# EAGLE design board (EAGLE 9.6.2)
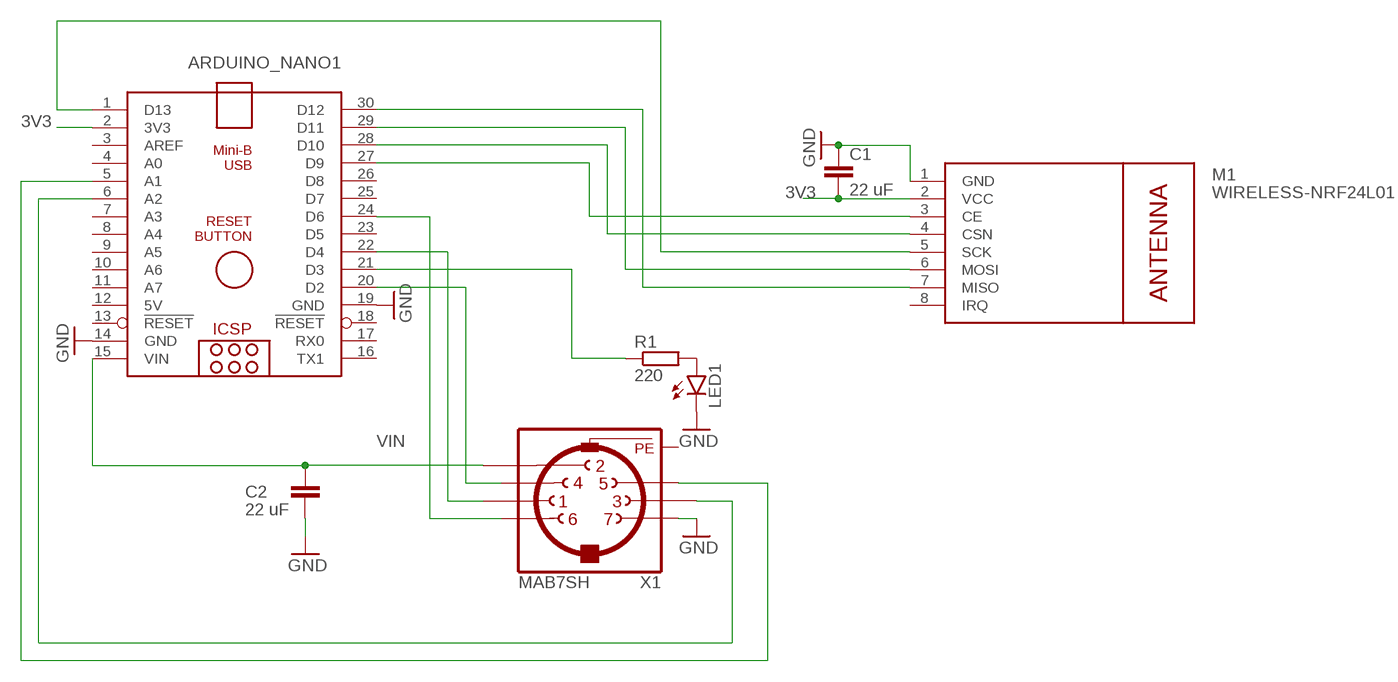
[diagram p0: schematic, sheet 1]

## Parts
ARDUINO_NANO1  ARDUINO_NANO  [ARDUINO_NANO]
C1  22 uF  C-EUC0805  [C0805]
C2  22 uF  C-EUC0805  [C0805]
LED1  LED5MM  [LED5MM]
M1  WIRELESS-NRF24L01  [WIRELESS-NRF24L01]
R1  220  R-EU_R0805  [R0805]
X1  MAB7SH  [MAB7SH]

## Nets
3V3: ARDUINO_NANO1.2(3V3) C1.2 M1.2(VCC)
GND: ARDUINO_NANO1.14(GND) ARDUINO_NANO1.19(GND) C1.1 C2.2 LED1.K(C) M1.1(GND) X1.7
N$1: ARDUINO_NANO1.1(D13) M1.5(SCK)
N$2: ARDUINO_NANO1.30(D12) M1.7(MISO)
N$3: ARDUINO_NANO1.29(D11) M1.6(MOSI)
N$4: ARDUINO_NANO1.28(D10) M1.4(CSN)
N$5: ARDUINO_NANO1.27(D9) M1.3(CE)
N$6: LED1.A R1.2
N$7: ARDUINO_NANO1.21(D3) R1.1
N$8: ARDUINO_NANO1.24(D6) X1.6
N$10: ARDUINO_NANO1.22(D4) X1.1
N$11: ARDUINO_NANO1.5(A1) X1.5
N$12: ARDUINO_NANO1.20(D2) X1.4
N$13: ARDUINO_NANO1.6(A2) X1.3
VIN: ARDUINO_NANO1.15(VIN) C2.1 X1.2
Unconnected: ARDUINO_NANO1.3(AREF) ARDUINO_NANO1.4(A0) ARDUINO_NANO1.7(A3) ARDUINO_NANO1.8(A4) ARDUINO_NANO1.9(A5) ARDUINO_NANO1.10(A6) ARDUINO_NANO1.11(A7) ARDUINO_NANO1.13(!RESET) ARDUINO_NANO1.16(TX1) ARDUINO_NANO1.17(RX0) ARDUINO_NANO1.18(!RESET) ARDUINO_NANO1.23(D5) ARDUINO_NANO1.25(D7) ARDUINO_NANO1.26(D8) M1.8(IRQ)

## Power pins joined to a net without a drawn wire
5V: ARDUINO_NANO1.12(5V)
PE: X1.PE X1.PE@(PE)

## Library data of the parts
ARDUINO_NANO1 = ArduinoNanoV30:ARDUINO_NANO: Arduino Nano V3.0 Overview: The Arduino Nano is a small, complete, and breadboard-friendly board based on the ATmega328 (Arduino Nano 3.x) or ATmega168 (Arduino Nano 2.x). It has more or less the same functionality of the Arduino Duemilanove, but in a different package. It lacks only a DC power jack, and works with a Mini-B USB cable instead of a standard one. The Nano was designed and is being produced by Gravitech. Specifications: Microcontroller Atmel ATmega168 or ATmega328 Operating Voltage (logic level) 5 V Input Voltage (recommended) 7-12 V Input Voltage (limits) 6-20 V Digital I/O Pins 14 (of which 6 provide PWM output) Analog Input Pins 8 DC Current per I/O Pin 40 mA Flash Memory 16 KB (ATmega168) or 32 KB (ATmega328) of which 2 KB used by bootloader SRAM 1 KB (ATmega168) or 2 KB (ATmega328) EEPROM 512 bytes (ATmega168) or 1 KB (ATmega328) Clock Speed 16 MHz Dimensions 0.73" x 1.70" Length 45 mm Width 18 mm Weigth 5 g Power: The Arduino Nano can be powered via the Mini-B USB connection, 6-20V unregulated external power supply (pin 30), or 5V regulated external power supply (pin 27). The power source is automatically selected to the highest voltage source. Memory: The ATmega168 has 16 KB of flash memory for storing code (of which 2 KB is used for the bootloader); the ATmega328 has 32 KB, (also with 2 KB used for the bootloader). The ATmega168 has 1 KB of SRAM and 512 bytes of EEPROM (which can be read and written with the EEPROM library); the ATmega328 has 2 KB of SRAM and 1 KB of EEPROM. Input and Output: Each of the 14 digital pins on the Nano can be used as an input or output, using pinMode(), digitalWrite(), and digitalRead() functions. They operate at 5 volts. Each pin can provide or receive a maximum of 40 mA and has an internal pull-up resistor (disconnected by default) of 20-50 kOhms. In addition, some pins have specialized functions. Visit Arduino - ArduinoBoardNano <https://www.arduino.cc/en/Main/ArduinoBoardNano>
C1 C2 = rcl:C-EU: CAPACITOR, European symbol; SPICEPREFIX: C
LED1 = led:LED: LED OSRAM: - CHIPLED LG R971, LG N971, LY N971, LG Q971, LY Q971, LO R971, LY R971 LH N974, LH R974 LS Q976, LO Q976, LY Q976 LO Q996 - Hyper CHIPLED LW Q18S LB Q993, LB Q99A, LB R99A - SideLED LS A670, LO A670, LY A670, LG A670, LP A670 LB A673, LV A673, LT A673, LW A673 LH A674 LY A675 LS A676, LA A676, LO A676, LY A676, LW A676 LS A679, LY A679, LG A679 - Hyper Micro SIDELED® LS Y876, LA Y876, LO Y876, LY Y876 LT Y87S - SmartLED LW L88C, LW L88S LB L89C, LB L89S, LG L890 LS L89K, LO L89K, LY L89K LS L896, LA L896, LO L896, LY L896 - TOPLED LS T670, LO T670, LY T670, LG T670, LP T670 LSG T670, LSP T670, LSY T670, LOP T670, LYG T670 LG T671, LOG T671, LSG T671 LB T673, LV T673, LT T673, LW T673 LH T674 LS T676, LA T676, LO T676, LY T676, LB T676, LH T676, LSB T676, LW T676 LB T67C, LV T67C, LT T67C, LS T67K, LO T67K, LY T67K, LW E67C LS E67B, LA E67B, LO E67B, LY E67B, LB E67C, LV E67C, LT E67C LW T67C LS T679, LY T679, LG T679 LS T770, LO T770, LY T770, LG T770, LP T770 LB T773, LV T773, LT T773, LW T773 LH T774 LS E675, LA E675, LY E675, LS T675 LS T776, LA T776, LO T776, LY T776, LB T776 LHGB T686 LT T68C, LB T68C - Hyper Mini TOPLED® LB M676 - Mini TOPLED Santana® LG M470 LS M47K, LO M47K, LY M47K Source: http://www.osram.convergy.de LUXEON: - LUMILED® LXK2-PW12-R00, LXK2-PW12-S00, LXK2-PW14-U00, LXK2-PW14-V00 LXK2-PM12-R00, LXK2-PM12-S00, LXK2-PM14-U00 LXK2-PE12-Q00, LXK2-PE12-R00, LXK2-PE12-S00, LXK2-PE14-T00, LXK2-PE14-U00 LXK2-PB12-K00, LXK2-PB12-L00, LXK2-PB12-M00, LXK2-PB14-N00, LXK2-PB14-P00, LXK2-PB14-Q00 LXK2-PR12-L00, LXK2-PR12-M00, LXK2-PR14-Q00, LXK2-PR14-R00 LXK2-PD12-Q00, LXK2-PD12-R00, LXK2-PD12-S00 LXK2-PH12-R00, LXK2-PH12-S00 LXK2-PL12-P00, LXK2-PL12-Q00, LXK2-PL12-R00 Source: www.luxeon.com KINGBRIGHT: KA-3528ASYC Source: www.kingbright.com
M1 = nrf24l01:WIRELESS-NRF24L01: 2.4 GHz Wireless Module based on NRF24L01 chip More details available here: http://www.electrodragon.com/w/NRF24L01 Click here to find device on ebay.com <http://www.ebay.com/sch/nrf24l01+arduino>
R1 = rcl:R-EU_: RESISTOR, European symbol; SPICEPREFIX: R
X1 = con-hirschmann:MAB7SH: Female CONNECTOR 7 pins with shield, horizontal (DIN 45329); OC_FARNELL: unknown; OC_NEWARK: unknown

## Board
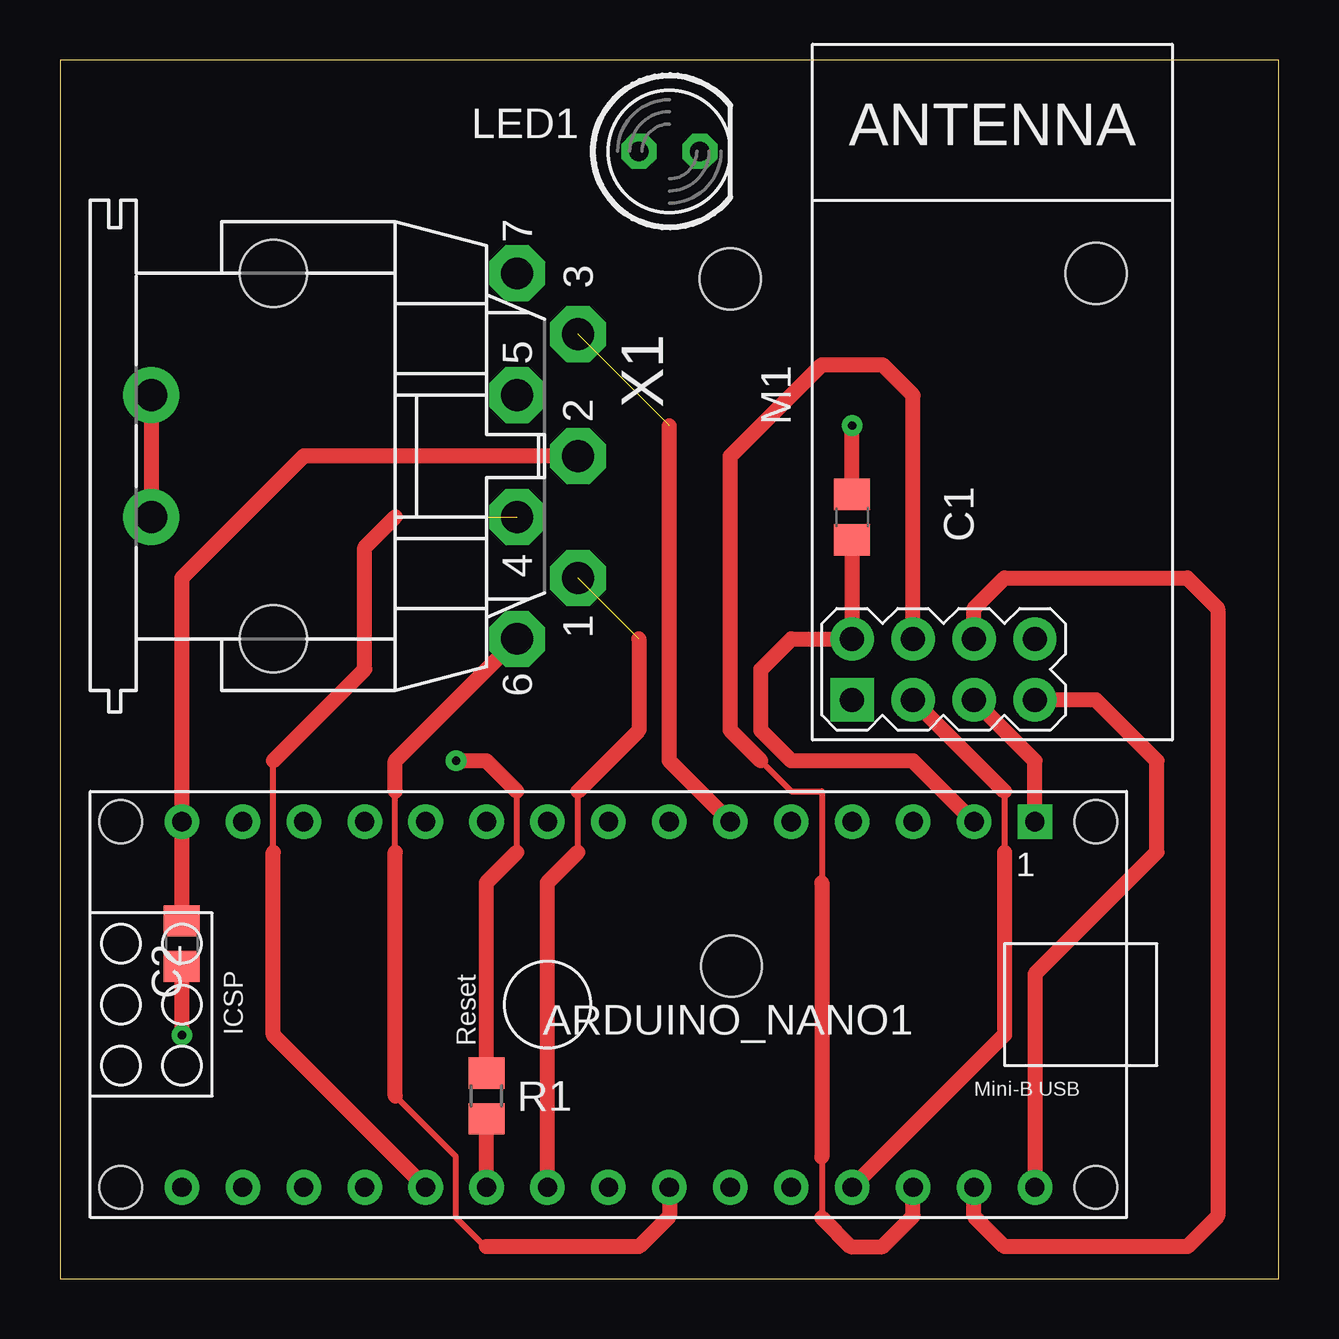
[diagram p1: board, top side]
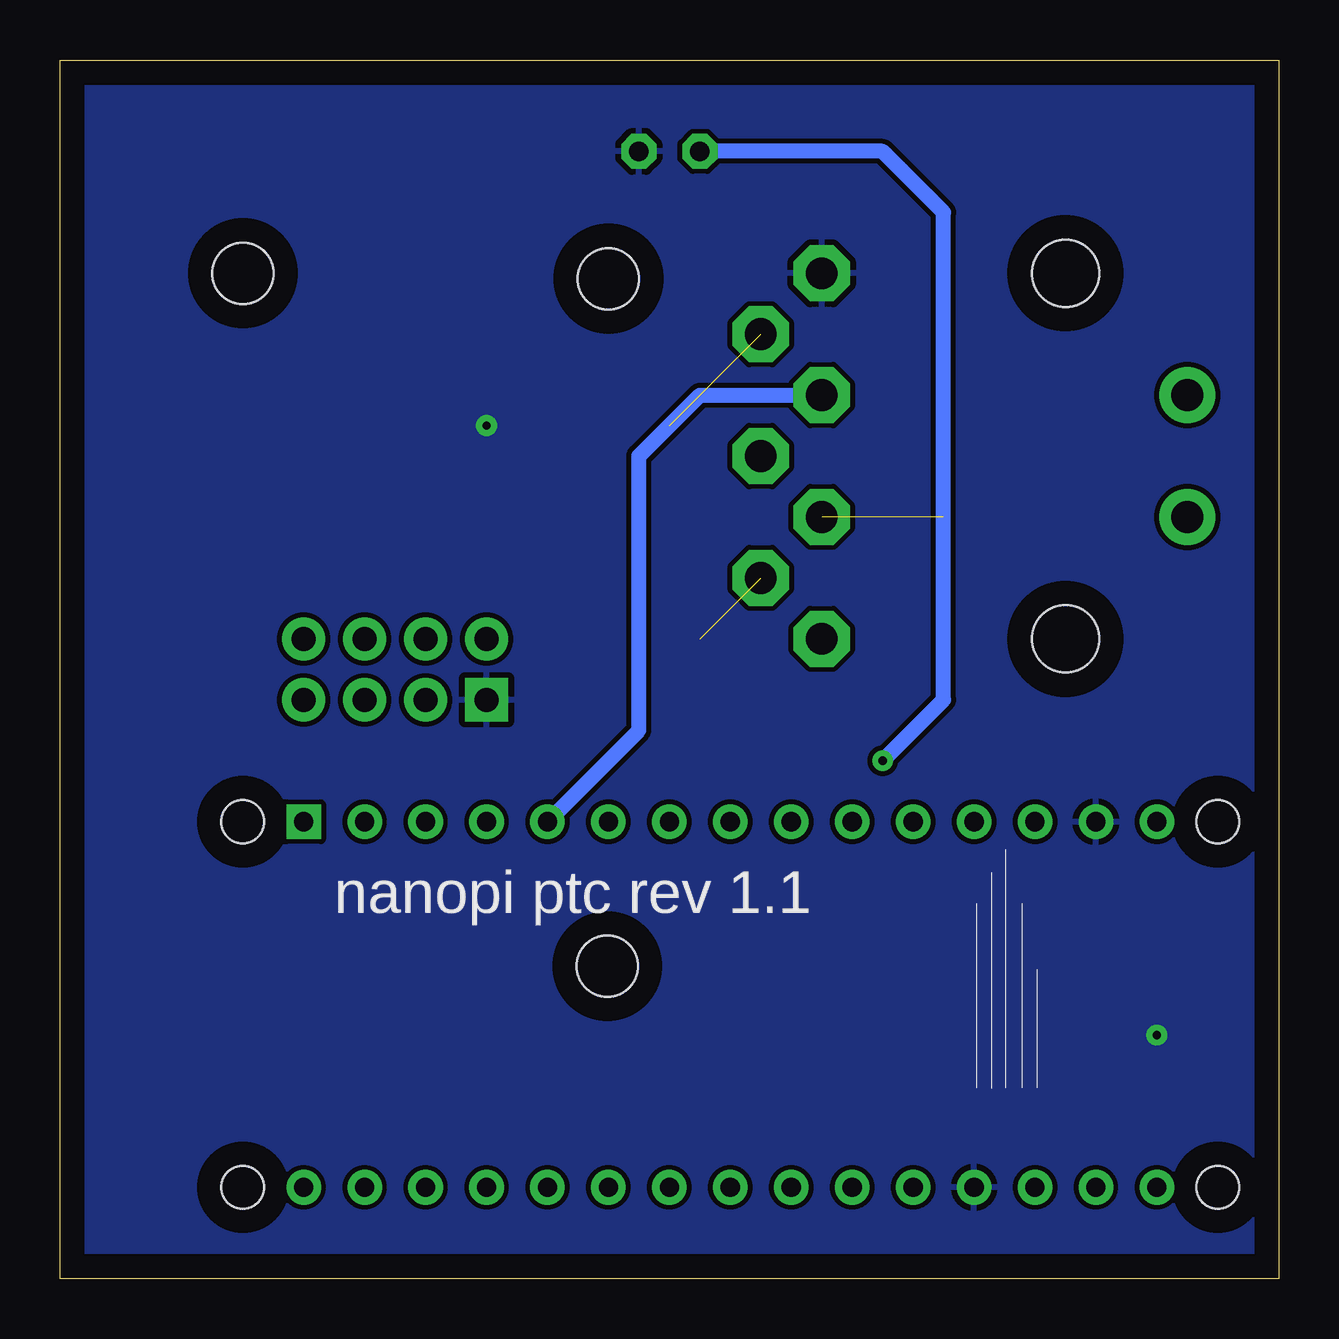
[diagram p2: board, bottom side, seen from below]

Size 50.8 x 50.8 mm. Coordinates in mm from the lower left corner, seen from the top.
Outline: 0,0 50.8,0 50.8,50.8 0,50.8 0,0
Copper layers (1*16): Top 0.035mm / dielectric 1.5mm / Bottom 0.035mm
Design rules "default *": minimum track width 10mil, minimum drill 0.35mm, track to track 8mil, track to pad 8mil, pad to pad 6mil, via to via 6mil, smd to smd 6mil, copper to edge 40mil, drill to drill 6mil, minimum pad ring 12mil, minimum via ring 10mil, stop-mask expansion 4mil, vias tented up to drill 0mil, thermal gap 10mil
Holes 2.54 mm at 43.18,41.91 27.99,13.03 27.94,41.68

### Footprints (pad centres in the part's own frame; a part is rotated, then mirrored left to right if it is on the bottom)
ARDUINO_NANO = drill 0.8 square: 1 -20.32,-7.62 | drill 0.8: 2 -17.78,-7.62; 3 -15.24,-7.62; 4 -12.7,-7.62; 5 -10.16,-7.62; 6 -7.62,-7.62; 7 -5.08,-7.62; 8 -2.54,-7.62; 9 0,-7.62; 10 2.54,-7.62; 11 5.08,-7.62; 12 7.62,-7.62; 13 10.16,-7.62; 14 12.7,-7.62; 15 15.24,-7.62; 16 15.24,7.62; 17 12.7,7.62; 18 10.16,7.62; 19 7.62,7.62; 20 5.08,7.62; 21 2.54,7.62; 22 0,7.62; 23 -2.54,7.62; 24 -5.08,7.62; 25 -7.62,7.62; 26 -10.16,7.62; 27 -12.7,7.62; 28 -15.24,7.62; 29 -17.78,7.62; 30 -20.32,7.62 | hole 1.778: -22.86,-7.62; -22.86,7.62; 17.78,7.62; 17.78,-7.62
C0805 = smd 1.3 x 1.5: 1 -0.95,0; 2 0.95,0
LED5MM = drill 0.813 octagon: A -1.27,0; K 1.27,0
WIRELESS-NRF24L01 = drill 1 square: 1 -12.7,6.35 | drill 1: 2 -10.16,6.35; 3 -12.7,3.81; 4 -10.16,3.81; 5 -12.7,1.27; 6 -10.16,1.27; 7 -12.7,-1.27; 8 -10.16,-1.27
R0805 = smd 1.3 x 1.5: 1 -0.95,0; 2 0.95,0
MAB7SH = drill 1.321 octagon: 1 5.08,12.7; 2 0,12.7; 3 -5.08,12.7; 4 2.54,10.16; 5 -2.54,10.16; 6 7.62,10.16; 7 -7.62,10.16 | drill 1.321: PE -2.54,-5.08; PE@ 2.54,-5.08 | hole 2.794: 7.62,0; -7.62,0

### Placement (x,y rotation side)
ARDUINO_NANO1  20.32,11.43 180 top
C1  33.02,31.75 270 top
C2  5.08,13.97 270 top
LED1  25.4,46.99 0 top
M1  39.37,36.83 90 top
R1  17.78,7.62 90 top
X1  8.89,34.29 270 top

### Tracks (layer width: path | path; a pad name or v marks a point on that pad's centre or on a via)
3V3
  Top 0.635: C1.2 M1.2 30.48,26.67 29.21,25.4 29.21,22.86 30.48,21.59 35.56,21.59 ARDUINO_NANO1.2
GND  (via drill 0.35 pad 0.8)
  Top 0.635: C1.1 v33.02,35.56 | C2.2 v5.08,10.16
  pour Bottom (isolate 0): 0,50.8 50.8,50.8 50.8,0 0,0
N$1
  Top 0.635: ARDUINO_NANO1.1 40.64,21.59 M1.5
N$2
  Top 0.635: M1.7 43.18,24.13 45.72,21.59 45.72,17.78 40.64,12.7 ARDUINO_NANO1.30
N$3
  Top 0.635: M1.6 38.1,27.94 39.37,29.21 46.99,29.21 48.26,27.94 48.26,2.6 46.99,1.33 39.37,1.33 38.1,2.6 ARDUINO_NANO1.29
N$4
  Top 0.254: 29.21,21.59 30.48,20.32 31.75,20.32 31.75,16.51 | 31.75,5.08 31.75,2.54
  Top 0.635: M1.4 35.56,36.83 34.29,38.1 31.75,38.1 27.94,34.29 27.94,22.86 29.21,21.59 | 31.75,16.51 31.75,5.08 | 31.75,2.54 32.96,1.33 34.29,1.33 35.56,2.6 ARDUINO_NANO1.28
N$5
  Top 0.254: 39.37,20.32 39.37,17.78
  Top 0.635: M1.3 39.37,20.32 | 39.37,17.78 39.37,10.16 ARDUINO_NANO1.27
N$6  (via drill 0.35 pad 0.8)
  Top 0.254: 19.05,17.78 19.05,20.32
  Top 0.635: R1.2 17.78,16.51 19.05,17.78 | 19.05,20.32 17.78,21.59 v16.51,21.59
  Bottom 0.635: v16.51,21.59 13.97,24.13 13.97,44.45 16.51,46.99 LED1.A
N$7
  Top 0.635: ARDUINO_NANO1.21 R1.1
N$8
  Top 0.254: 17.78,1.33 17.72,1.33 16.51,2.54 16.51,5.08 13.97,7.62 | 13.97,17.78 13.97,20.32
  Top 0.635: ARDUINO_NANO1.24 25.4,2.6 24.13,1.33 17.78,1.33 | 13.97,7.62 13.97,17.78 | 13.97,20.32 13.97,21.59 X1.6
N$10  (1 unrouted)
  Top 0.254: 21.59,17.78 21.59,20.32
  Top 0.635: ARDUINO_NANO1.22 20.32,16.51 21.59,17.78 | 24.13,26.67 24.13,22.86 21.59,20.32
N$11
  Bottom 0.635: ARDUINO_NANO1.5 26.67,22.86 26.67,34.29 24.13,36.83 X1.5
N$12  (1 unrouted)
  Top 0.254: 8.89,17.78 8.89,21.59
  Top 0.635: ARDUINO_NANO1.20 8.89,10.16 8.89,17.78 | 13.97,31.75 12.7,30.48 12.7,25.4 8.89,21.59
N$13  (1 unrouted)
  Top 0.635: ARDUINO_NANO1.6 25.4,21.59 25.4,35.56
PE
  Top 0.635: X1.PE X1.PE@
VIN
  Top 0.635: C2.1 ARDUINO_NANO1.15 5.08,29.21 10.16,34.29 X1.2

### Text on the board
bPlace: nanopi ptc rev 1.1